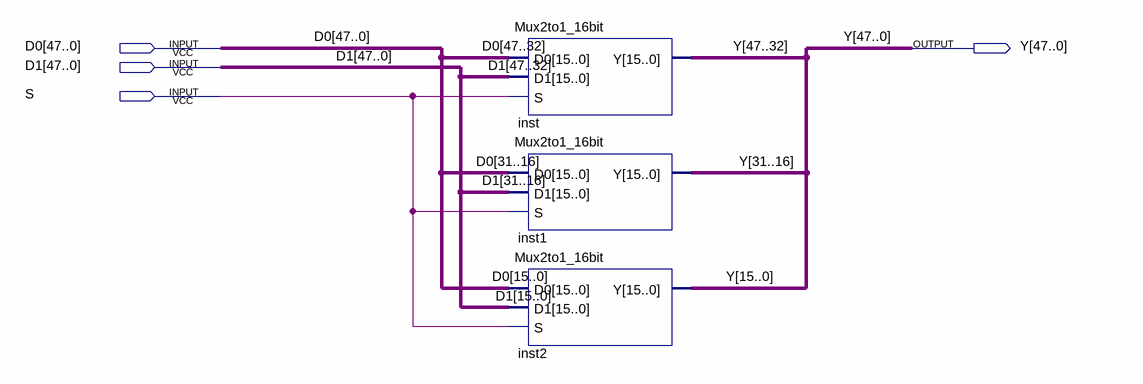
[diagram p0: schematic sheet]
// Quartus schematic Mux2to1_48bit.bdf as structural Verilog: 3 symbols, 4 pins
module Mux2to1_48bit (
  input  [47:0] D0,
  input  [47:0] D1,
  input  S,
  output [47:0] Y
);

  Mux2to1_16bit inst (.D0(D0[47:32]), .D1(D1[47:32]), .S(S), .Y(Y[47:32]));
  Mux2to1_16bit inst1 (.D0(D0[31:16]), .D1(D1[31:16]), .S(S), .Y(Y[31:16]));
  Mux2to1_16bit inst2 (.D0(D0[15:0]), .D1(D1[15:0]), .S(S), .Y(Y[15:0]));
endmodule
